# Altium schematic sheet BI6.SchDoc
size 420 x 297 mm; DocumentNumber: 11; SheetNumber: 11; SheetTotal: 13; DecimalNumber: СНАБ.468222.001 ЭЗ
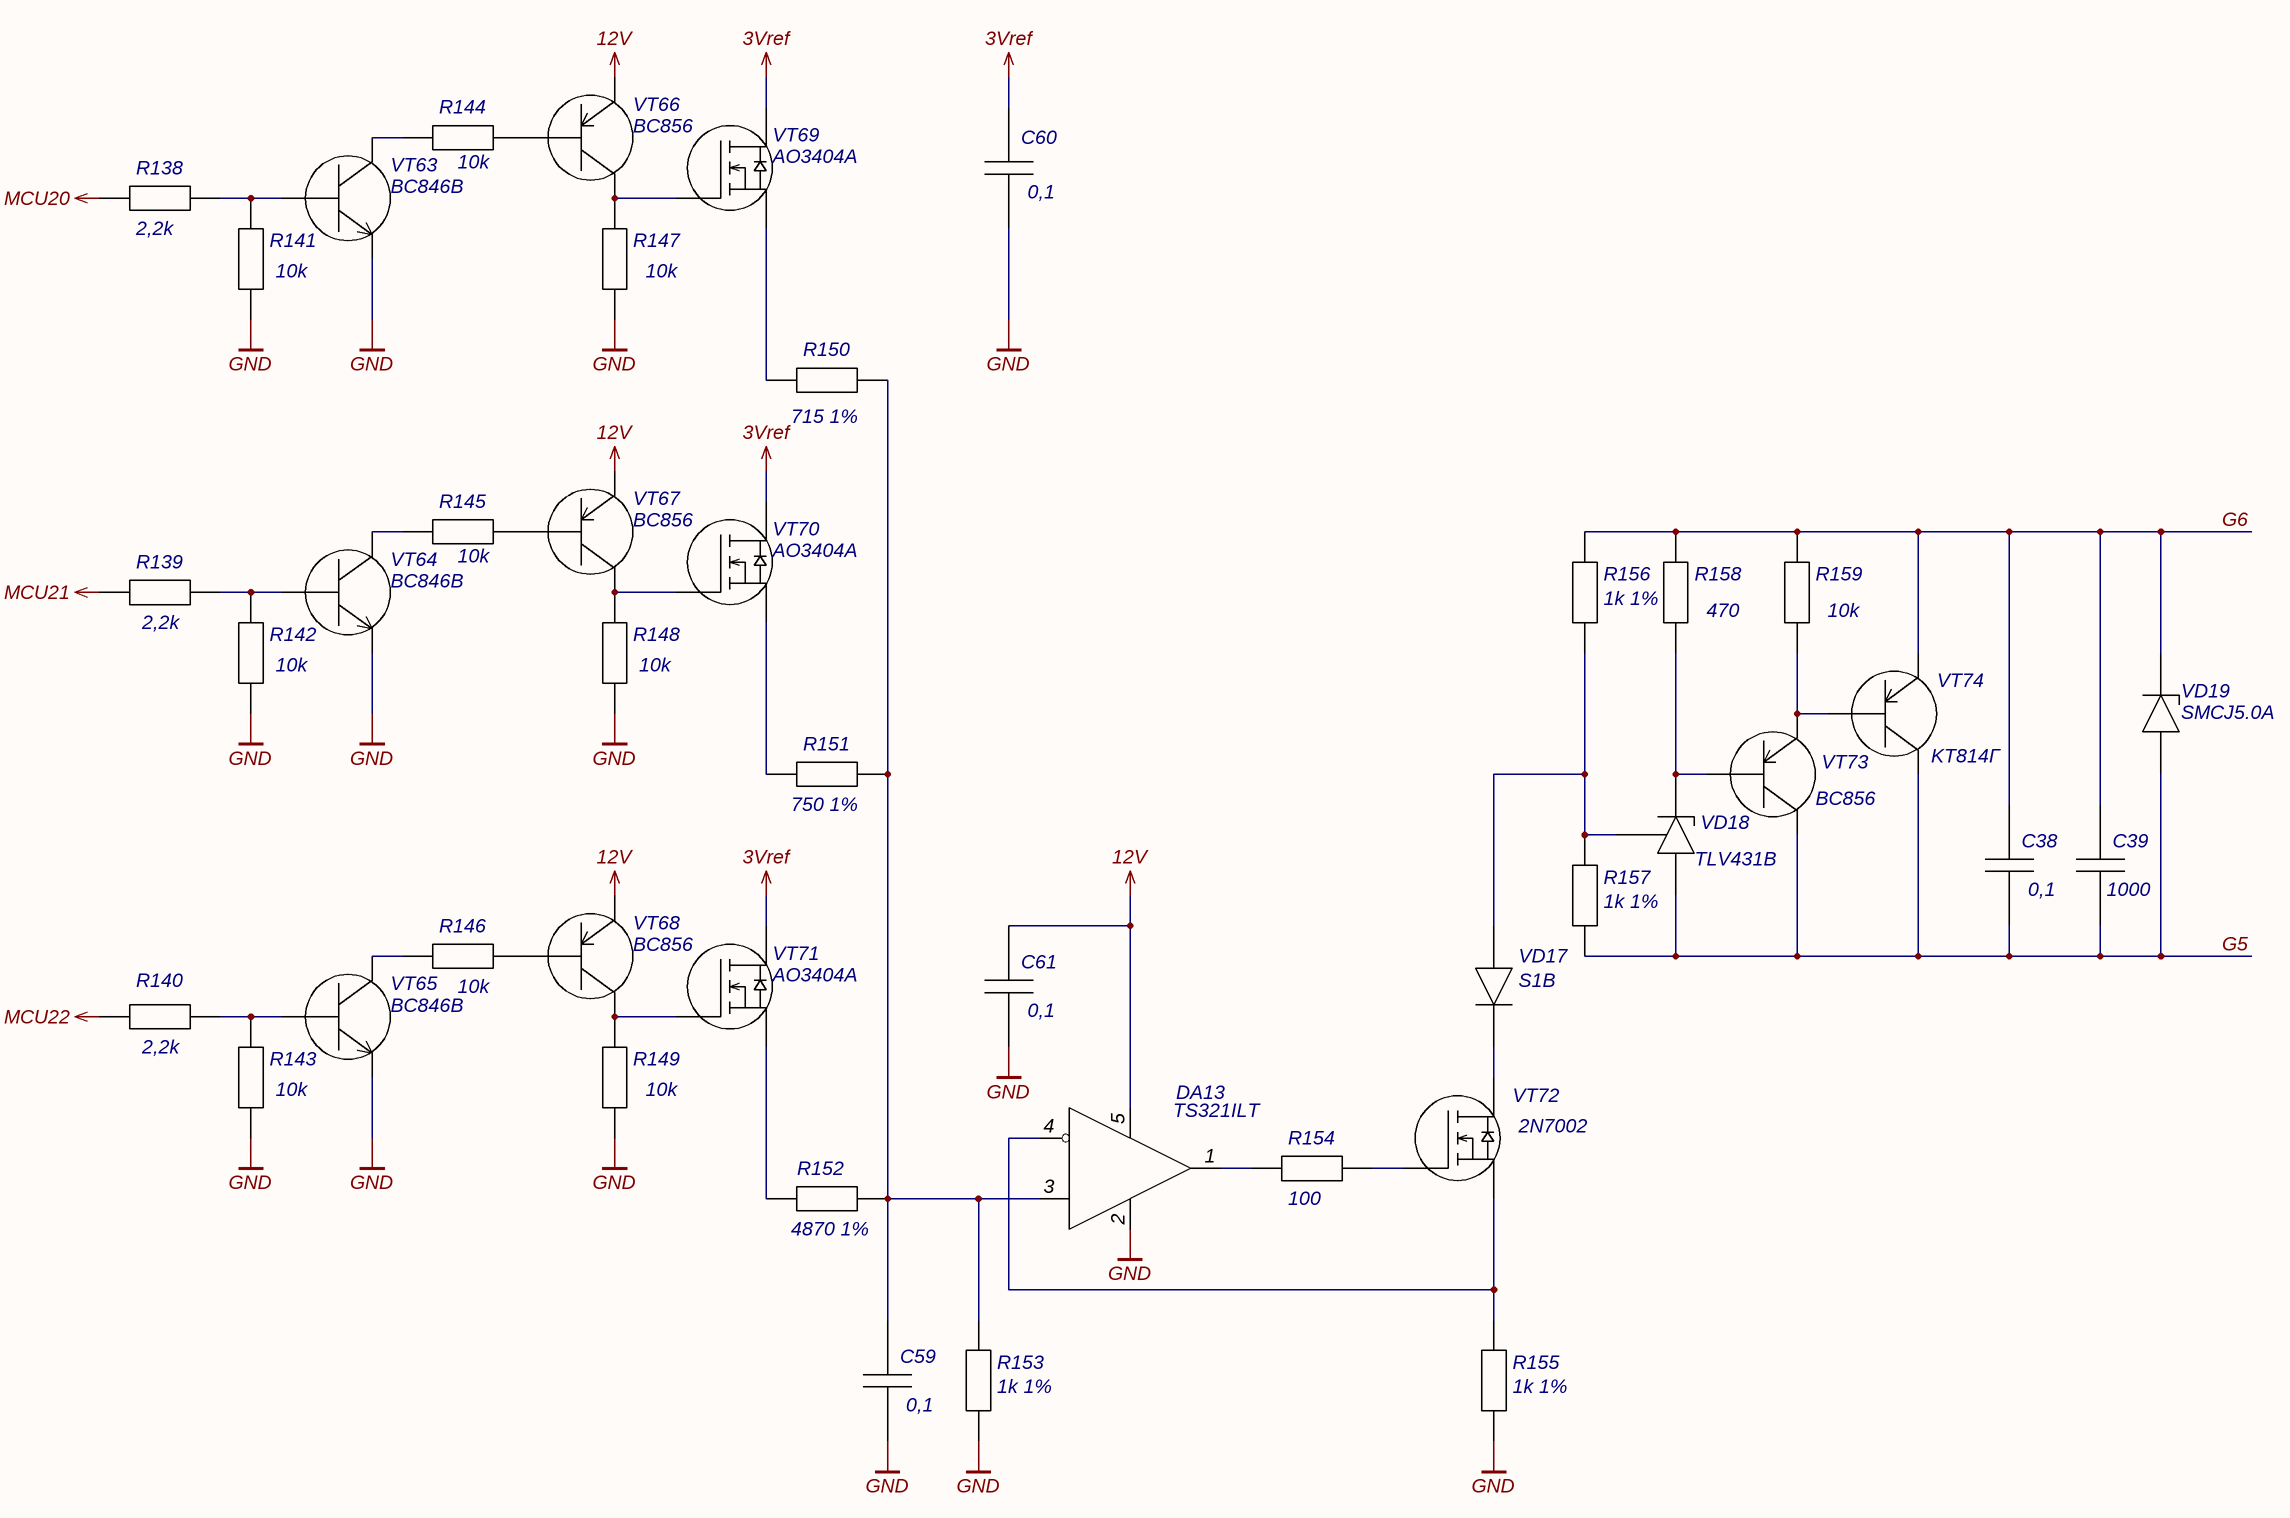
[diagram p0: BI6.SchDoc]

## Parts
C38  0,1  [C0603]
C39  1000  [C0603]
C59  0,1  [C0603]
C60  0,1  [C0603]
C61  0,1  [C0603]
DA13  TS321ILT  [SOT-23-5]
R138  2,2k  [R0603]
R139  2,2k  [R0603]
R140  2,2k  [R0603]
R141  10k  [R0603]
R142  10k  [R0603]
R143  10k  [R0603]
R144  10k  [R0603]
R145  10k  [R0603]
R146  10k  [R0603]
R147  10k  [R0603]
R148  10k  [R0603]
R149  10k  [R0603]
R150  715 1%  [R0603]
R151  750 1%  [R0603]
R152  4870 1%  [R0603]
R153  1k 1%  [R0603]
R154  100  [R0603]
R155  1k 1%  [R0603]
R156  1k 1%  [R0603]
R157  1k 1%  [R0603]
R158  470  [R0603]
R159  10k  [R0603]
VD17  S1B  [DO-214AC]
VD18  TLV431B  [SOT-23]
VD19  SMCJ5.0A  [DO-214AB]
VT63  BC846B  [SOT-23]
VT64  BC846B  [SOT-23]
VT65  BC846B  [SOT-23]
VT66  BC856  [SOT-23]
VT67  BC856  [SOT-23]
VT68  BC856  [SOT-23]
VT69  AO3404A  [SOT-23]
VT70  AO3404A  [SOT-23]
VT71  AO3404A  [SOT-23]
VT72  2N7002  [SOT-23]
VT73  BC856  [SOT-23]
VT74  KT814Г  [TO-126]

## Nets
3Vref: C60.2 VT69.2(D) VT70.2(D) VT71.2(D)
12V: C61.2 DA13.5(Vcc) VT66.1 VT67.1 VT68.1
GND: C59.1 C60.1 C61.1 DA13.2(GND) R141.1 R142.1 R143.1 R147.1 R148.1 R149.1 R153.1 R155.1 VT63.2(E) VT64.2(E) VT65.2(E)
MCU20: R138.1
MCU21: R139.1
MCU22: R140.1
G5: C38.1 C39.1 R157.1 VD18.1 VD19.1 VT73.2 VT74.2
G6: C38.2 C39.2 R156.2 R158.2 R159.2 VD19.2 VT74.1
NetC59_2: C59.2 DA13.3(+) R150.2 R151.2 R152.2 R153.2
NetDA13_1: DA13.1(OUT) R154.1
NetDA13_4: DA13.4(-) R155.2 VT72.3(S)
NetR138_2: R138.2 R141.2 VT63.1(B)
NetR139_2: R139.2 R142.2 VT64.1(B)
NetR140_2: R140.2 R143.2 VT65.1(B)
NetR144_1: R144.1 VT63.3(C)
NetR144_2: R144.2 VT66.3
NetR145_1: R145.1 VT64.3(C)
NetR145_2: R145.2 VT67.3
NetR146_1: R146.1 VT65.3(C)
NetR146_2: R146.2 VT68.3
NetR147_2: R147.2 VT66.2 VT69.1(G)
NetR148_2: R148.2 VT67.2 VT70.1(G)
NetR149_2: R149.2 VT68.2 VT71.1(G)
NetR150_1: R150.1 VT69.3(S)
NetR151_1: R151.1 VT70.3(S)
NetR152_1: R152.1 VT71.3(S)
NetR154_2: R154.2 VT72.1(G)
NetR156_1: R156.1 R157.2 VD17.1 VD18.3
NetR158_1: R158.1 VD18.2 VT73.3
NetR159_1: R159.1 VT73.1 VT74.3
NetVD17_2: VD17.2 VT72.2(D)

## Notes on the sheet
- Подп. и дата
- Инв.№ дубл.
- Взам.инв.№
- Подп.и дата
- Инв.№ подл.
- Изм.
- Лист
- № докум.
- Подп.
- Дата
- Копировал
- Формат  A3

## Library data of the parts
C38 C39 C59-C61 = Chip Capasitor: Чип-конденсатор
  C38 C59-C61: Value: 0,1
  C39: Value: 1000
DA13 = TS321ILT: 1х Операционный усилитель; Manufacurer: STMicroelectronics; Case: SOT-23-5; Name: TS321ILT; Datasheet: https://static.chipdip.ru/lib/710/DOC011710227.pdf
R138-R149 R154 R158 R159 = Chip Resistor: Чип-резистор
  R138-R140: Value: 2,2k
  R141-R149 R159: Value: 10k
  R154: Value: 100
  R158: Value: 470
R150 = Chip Resistor: Чип-резистор; Partnumber: RC0603FR-07715RL; Value: 715 1%; URL: https://www.chipdip.ru/product0/8002000768
R151 = Chip Resistor: Чип-резистор; Partnumber: RC0603FR-07750RL; Value: 750 1%; URL: https://www.chipdip.ru/product/0.1w-0603-750-om-1
R152 = Chip Resistor: Чип-резистор; Partnumber: RC0603FR-074K87L; Value: 4870 1%; URL: https://www.chipdip.ru/product0/8002000679
R153 R155-R157 = Chip Resistor: Чип-резистор; Partnumber: CRCW06031K00FKEAC; Value: 1k 1%; URL: https://www.chipdip.ru/product0/8002019285
VD17 = S1B: Диод выпрямительный, 100В; Manufacturer: Diotec Semiconductor; Case: DO-214AC; Name: S1B; Datasheet: https://static.chipdip.ru/lib/113/DOC032113174.pdf
VD18 = TLV431B: Стабилитрон регулируемый, 6В; Manufacturer: Texas Instruments; Case: SOT-23; Name: TLV431B; Datasheet: https://static.chipdip.ru/lib/985/DOC012985043.pdf
VD19 = SMCJ5.0A: Защитный диод, 5В; Manufacturer: UTD Semiconductor Co.,Ltd; Case: DO-201; Name: SMCJ5.0A; Datasheet: https://static.chipdip.ru/lib/863/DOC025863760.pdf
VT63-VT65 = BC846B: Транзистор биполярный NPN, 65В; Manufacturer: Nexperia B.V.; Case: SOT-23; Name: BC846B; Datasheet: https://static.chipdip.ru/lib/551/DOC012551042.pdf
VT66-VT68 VT73 = BC856: Транзистор биполярный PNP, 65В; Manufacturer: Nexperia; Case: SOT-23; Name: BC856; Datasheet: https://static.chipdip.ru/lib/365/DOC004365998.pdf
VT69-VT71 = AO3404A: Транзистор MOSFET N-канал, 30В; Manufacturer: UTD Semiconductor Co.,Ltd; Case: SOT-23; Name: AO3404A; Datasheet: https://static.chipdip.ru/lib/906/DOC012906979.pdf
VT72 = 2N7002: Транзистор MOSFET N-канал, 60В; Manufacturer: UTD Semiconductor Co.; Case: SOT-23; Name: 2N7002; Datasheet: https://static.chipdip.ru/lib/301/DOC021301072.pdf
VT74 = KT814Г: Транзистор биполярный PNP, 100В; Manufacturer: АО «ГРУППА КРЕМНИЙ ЭЛ»; TU: аАО.336.184 ТУ/02; Case: TO-126; Name: KT814Г; Datasheet: https://static.chipdip.ru/lib/404/DOC047404057.pdf